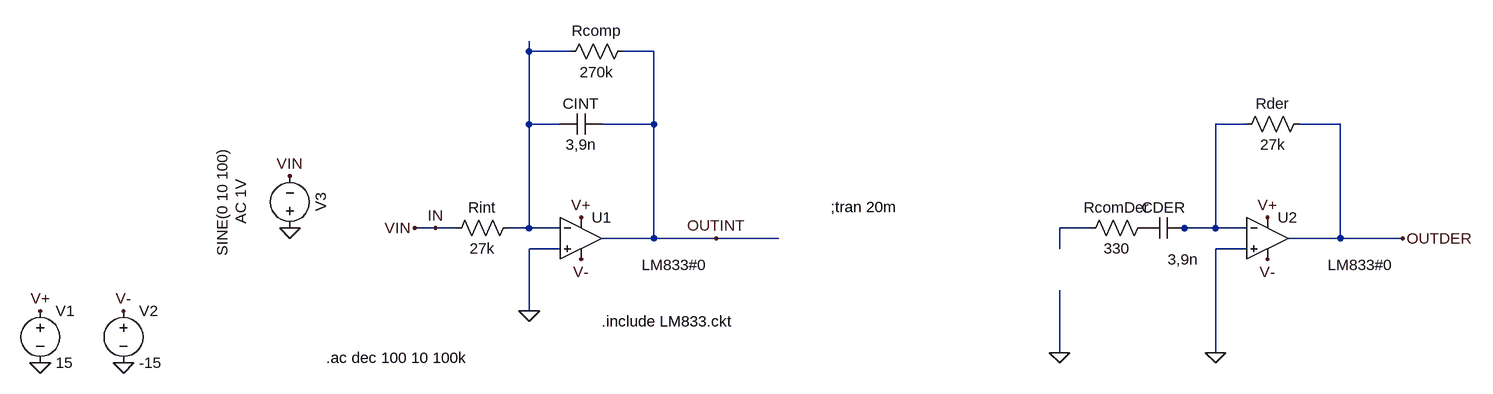
[diagram p0: schematic Integrador.asc]
Integrador.asc, the LTspice schematic file:
Version 4
SHEET 1 1812 680
WIRE 176 -96 176 -112
WIRE 240 -96 176 -96
WIRE 368 -96 320 -96
WIRE 176 16 176 -96
WIRE 224 16 176 16
WIRE 368 16 368 -96
WIRE 368 16 288 16
WIRE 1280 16 1232 16
WIRE 1424 16 1360 16
WIRE 32 176 0 176
WIRE 64 176 32 176
WIRE 176 176 176 16
WIRE 176 176 144 176
WIRE 224 176 176 176
WIRE 1040 176 992 176
WIRE 1184 176 1168 176
WIRE 1232 176 1232 16
WIRE 1232 176 1184 176
WIRE 1280 176 1232 176
WIRE 368 192 368 16
WIRE 368 192 288 192
WIRE 464 192 368 192
WIRE 560 192 464 192
WIRE 1424 192 1424 16
WIRE 1424 192 1344 192
WIRE 1520 192 1424 192
WIRE 224 208 176 208
WIRE 992 208 992 176
WIRE 1280 208 1232 208
WIRE 176 304 176 208
WIRE 992 368 992 272
WIRE 1232 368 1232 208
FLAG -448 384 0
FLAG -576 384 0
FLAG -576 304 V+
FLAG -448 304 V-
FLAG 256 160 V+
FLAG 256 224 V-
FLAG 464 192 OUTINT
FLAG 32 176 IN
FLAG 1312 160 V+
FLAG 1312 224 V-
FLAG 1232 368 0
FLAG 1520 192 OUTDER
FLAG -192 176 0
FLAG -192 96 VIN
FLAG 0 176 VIN
FLAG 992 368 0
FLAG 176 304 0
SYMBOL Opamps\\opamp2 256 128 R0
WINDOW 3 93 105 Left 2
SYMATTR InstName U1
SYMATTR Value LM833#0
SYMBOL voltage -576 288 R0
WINDOW 123 0 0 Left 0
WINDOW 39 0 0 Left 0
SYMATTR InstName V1
SYMATTR Value 15
SYMBOL voltage -448 288 R0
WINDOW 123 0 0 Left 0
WINDOW 39 0 0 Left 0
SYMATTR InstName V2
SYMATTR Value -15
SYMBOL voltage -192 192 R180
WINDOW 0 -32 56 VBottom 2
WINDOW 3 88 56 VTop 2
WINDOW 123 60 56 VTop 2
WINDOW 39 0 0 Left 0
SYMATTR InstName V3
SYMATTR Value SINE(0 10 100)
SYMATTR Value2 AC 1V
SYMBOL cap 288 0 R90
WINDOW 0 0 32 VBottom 2
WINDOW 3 32 32 VTop 2
SYMATTR InstName CINT
SYMATTR Value 3,9n
SYMBOL res 160 160 R90
WINDOW 0 0 56 VBottom 2
WINDOW 3 32 56 VTop 2
SYMATTR InstName Rint
SYMATTR Value 27k
SYMBOL res 336 -112 R90
WINDOW 0 0 56 VBottom 2
WINDOW 3 32 56 VTop 2
SYMATTR InstName Rcomp
SYMATTR Value 270k
SYMATTR SpiceLine tol=5
SYMBOL Opamps\\opamp2 1312 128 R0
WINDOW 3 93 105 Left 2
SYMATTR InstName U2
SYMATTR Value LM833#0
SYMBOL cap 1184 160 R90
WINDOW 0 0 32 VBottom 2
WINDOW 3 49 2 VTop 2
SYMATTR InstName CDER
SYMATTR Value 3,9n
SYMBOL res 1376 0 R90
WINDOW 0 0 56 VBottom 2
WINDOW 3 32 56 VTop 2
SYMATTR InstName Rder
SYMATTR Value 27k
SYMBOL res 1136 160 R90
WINDOW 0 0 56 VBottom 2
WINDOW 3 32 56 VTop 2
SYMATTR InstName RcomDer
SYMATTR Value 330
TEXT 288 320 Left 2 !.include LM833.ckt
TEXT -136 376 Left 2 !.ac dec 100 10 100k
TEXT 640 144 Left 2 !;tran 20m

The netlist it stands for:
* Integrador.asc
XU1 0 N001 V+ V- OUTINT LM833#0  ; pins In+ In- V+ V- OUT
V1 V+ 0 15
V2 V- 0 -15
V3 0 VIN SINE(0 10 100) AC 1V
CINT OUTINT N001 3,9n
Rint N001 VIN 27k
Rcomp OUTINT N001 270k tol=5
XU2 0 N002 V+ V- OUTDER LM833#0  ; pins In+ In- V+ V- OUT
CDER N002 P001 3,9n
Rder OUTDER N002 27k
RcomDer P001 N003 330
.include LM833.ckt
.ac dec 100 10 100k
;tran 20m
.backanno
.end